# EAGLE design pce_pll (EAGLE 9.2.1)
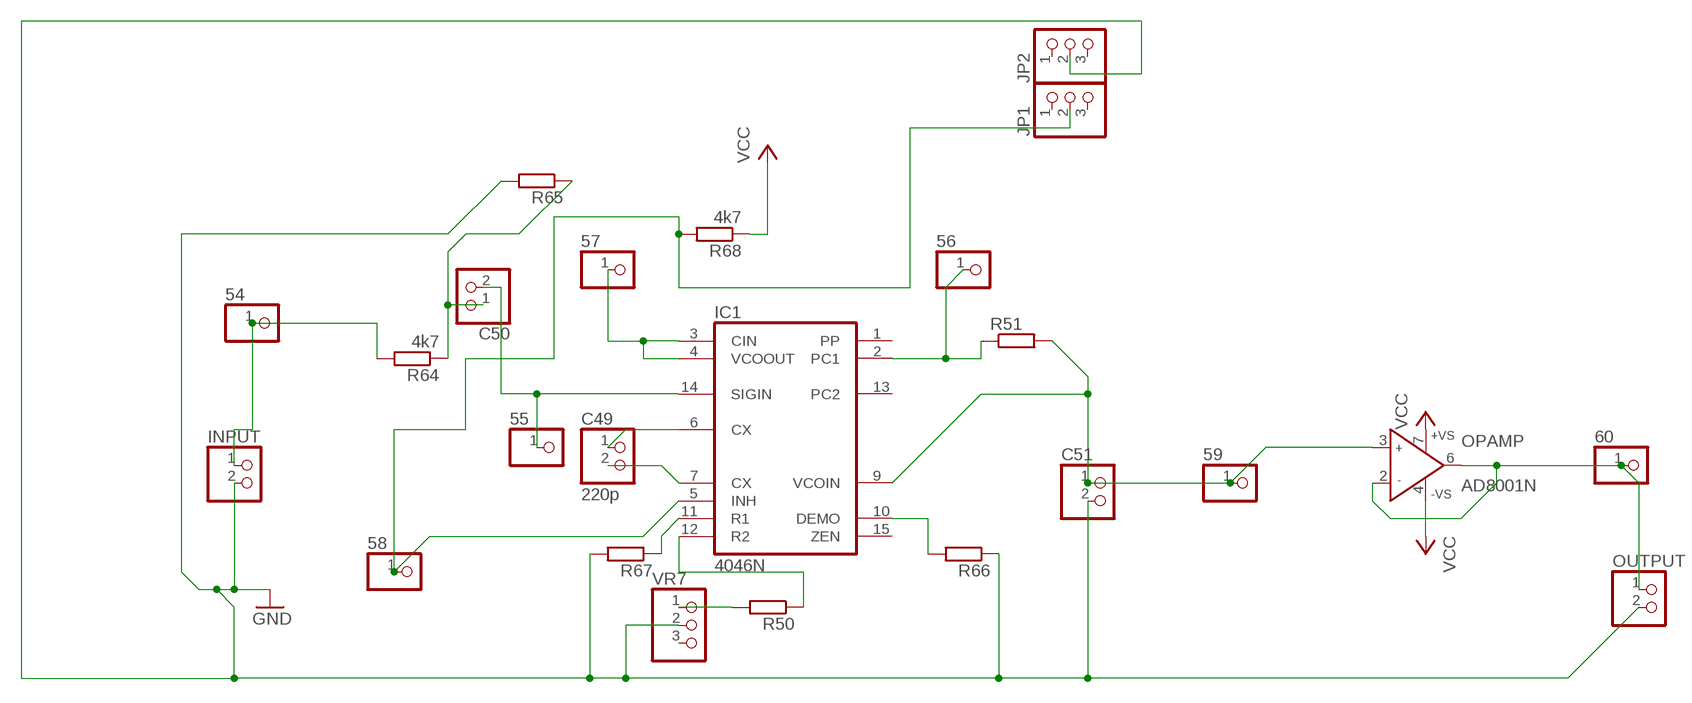
[diagram p0: schematic, sheet 1]

## Parts
54  PINHD-1X1  [1X01]
55  PINHD-1X1  [1X01]
56  PINHD-1X1  [1X01]
57  PINHD-1X1  [1X01]
58  PINHD-1X1  [1X01]
59  PINHD-1X1  [1X01]
60  PINHD-1X1  [1X01]
C49  220p  PINHD-1X2  [1X02]
C50  PINHD-1X2  [1X02]
C51  PINHD-1X2  [1X02]
IC1  4046N  [DIL16]
INPUT  PINHD-1X2  [1X02]
JP1  PINHD-1X3  [1X03]
JP2  PINHD-1X3  [1X03]
OPAMP  AD8001N  [DIL08]
OUTPUT  PINHD-1X2  [1X02]
R50  R-EU_0207/10  [0207/10]
R51  R-EU_0207/10  [0207/10]
R64  4k7  R-EU_0207/10  [0207/10]
R65  R-EU_0207/10  [0207/10]
R66  R-EU_0207/10  [0207/10]
R67  R-EU_0207/10  [0207/10]
R68  4k7  R-EU_0207/10  [0207/10]
VR7  PINHD-1X3  [1X03]

## Nets
54: 54.1 INPUT.1 R64.2
GND: C51.2 INPUT.2 JP2.2 OUTPUT.2 R65.2 R66.1 R67.2 VR7.2
N$1: 57.1 IC1.3(CIN) IC1.4(VCOOUT)
N$2: 56.1 IC1.2(PC1) R51.1
N$3: IC1.10(DEMO) R66.2
N$4: 55.1 C50.2 IC1.14(SIGIN)
N$5: C50.1 R64.1 R65.1
N$6: C49.1 IC1.6(CX)
N$7: C49.2 IC1.7(CX)
N$8: IC1.12(R2) R50.1
N$9: IC1.11(R1) R67.1
N$10: 60.1 OPAMP.2(IN-) OPAMP.6(OUT) OUTPUT.1
N$11: 59.1 C51.1 IC1.9(VCOIN) OPAMP.3(IN+) R51.2
N$13: 58.1 IC1.5(INH) JP1.2 R68.2
N$14: R50.2 VR7.1
VCC: OPAMP.4(-VS) OPAMP.7(+VS) R68.1
Unconnected: IC1.1(PP) IC1.13(PC2) IC1.15(ZEN) JP1.1 JP1.3 JP2.1 JP2.3 VR7.3

## Power pins joined to a net without a drawn wire
VDD: IC1.16(VDD)
VSS: IC1.8(VSS)

## Library data of the parts
54-60 = pinhead:PINHD-1X1: PIN HEADER
C49-C51 INPUT OUTPUT = pinhead:PINHD-1X2: PIN HEADER
IC1 = 40xx:4046: Micropower PLL
JP1 JP2 VR7 = pinhead:PINHD-1X3: PIN HEADER
OPAMP = analog-devices:AD8001: 800 MHz, 50 mW Current Feedback Amplifier Source: http://www.analog.com/static/imported-files/data_sheets/AD8001.pdf; MPN: AD8001ANZ; OC_FARNELL: 9605304; OC_NEWARK: 19M0911
R50 R51 R64-R68 = resistor:R-EU_: RESISTOR, European symbol

## Board
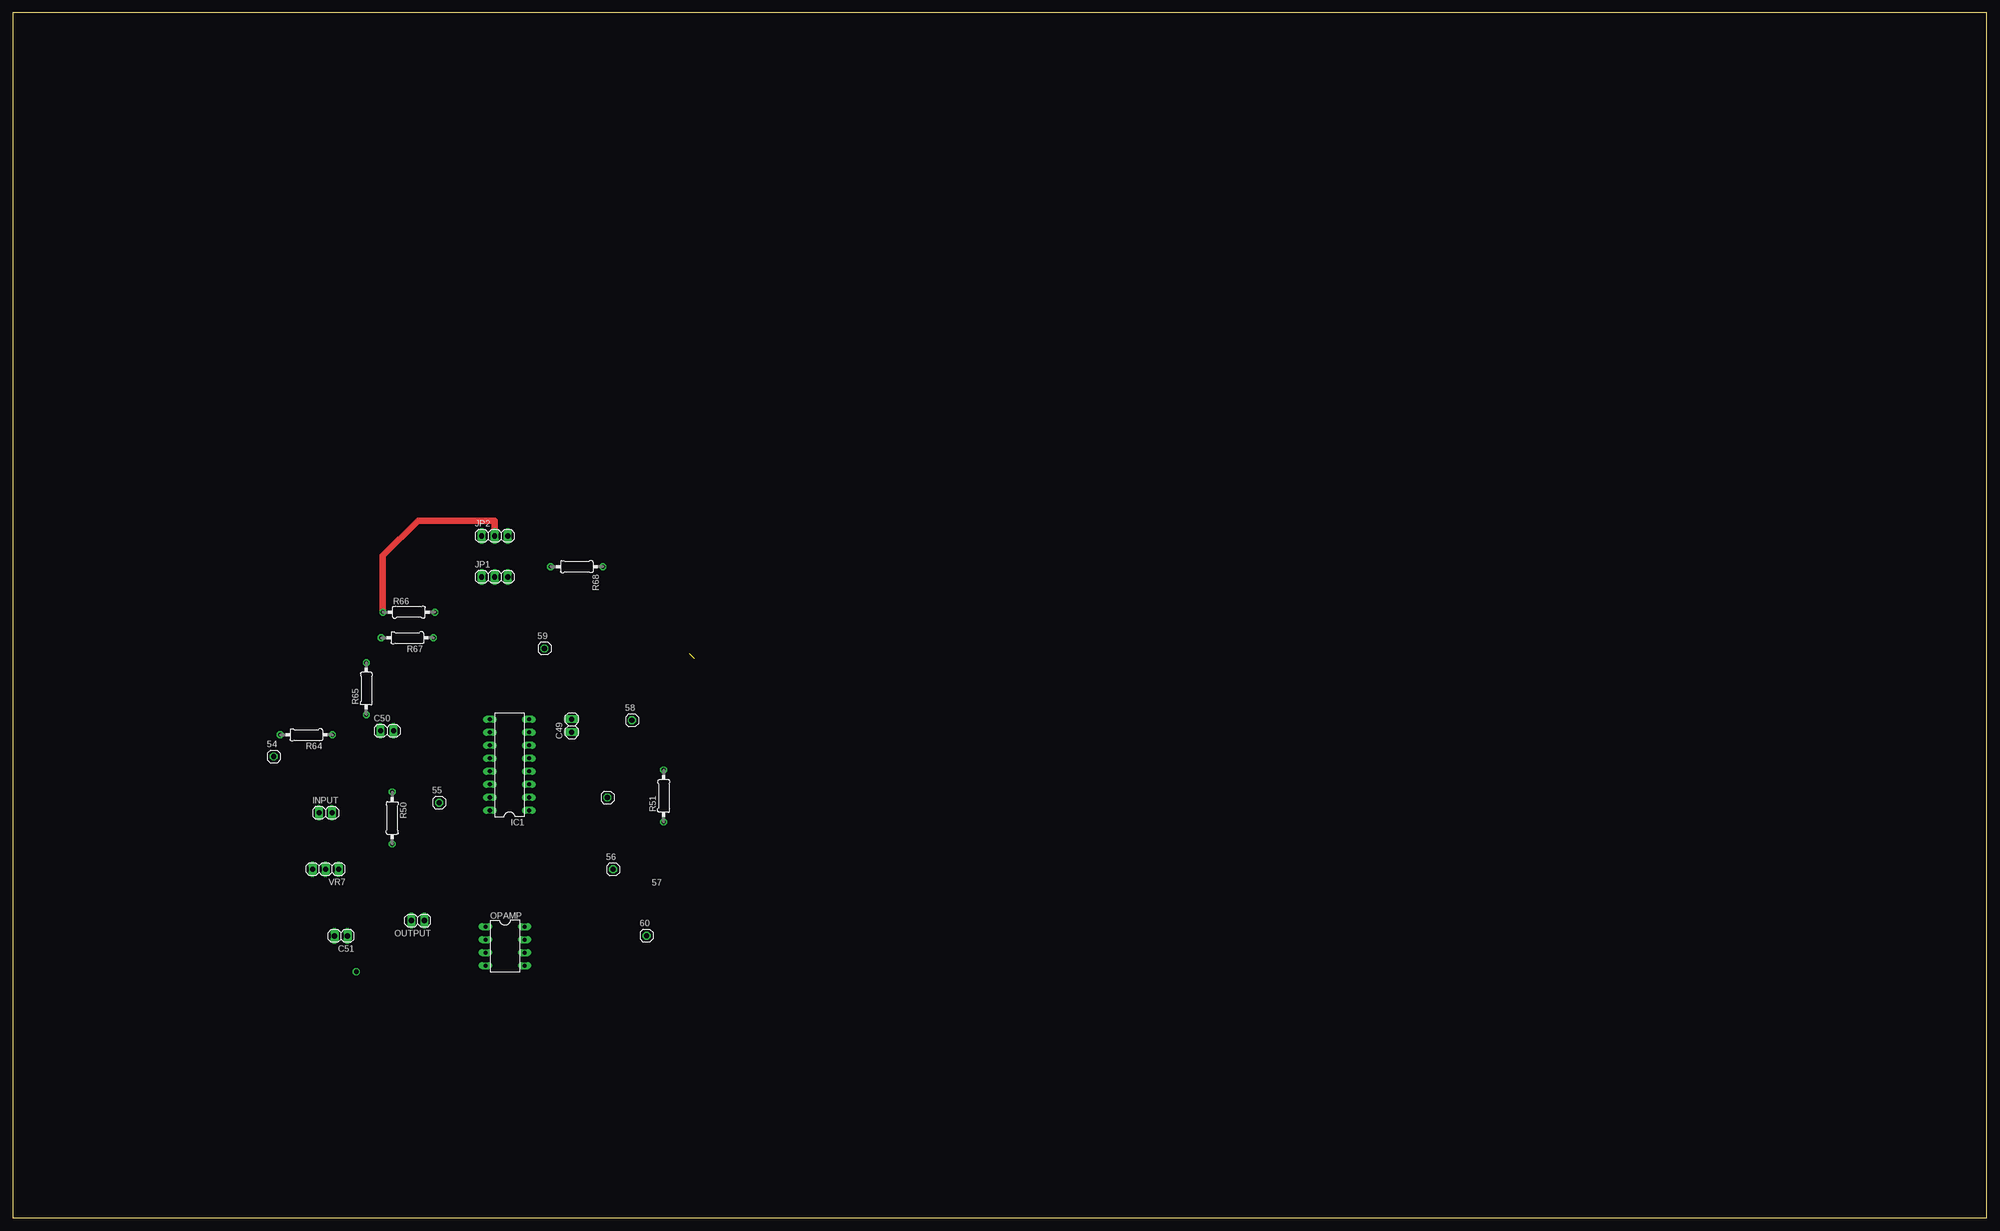
[diagram p1: board, top side]
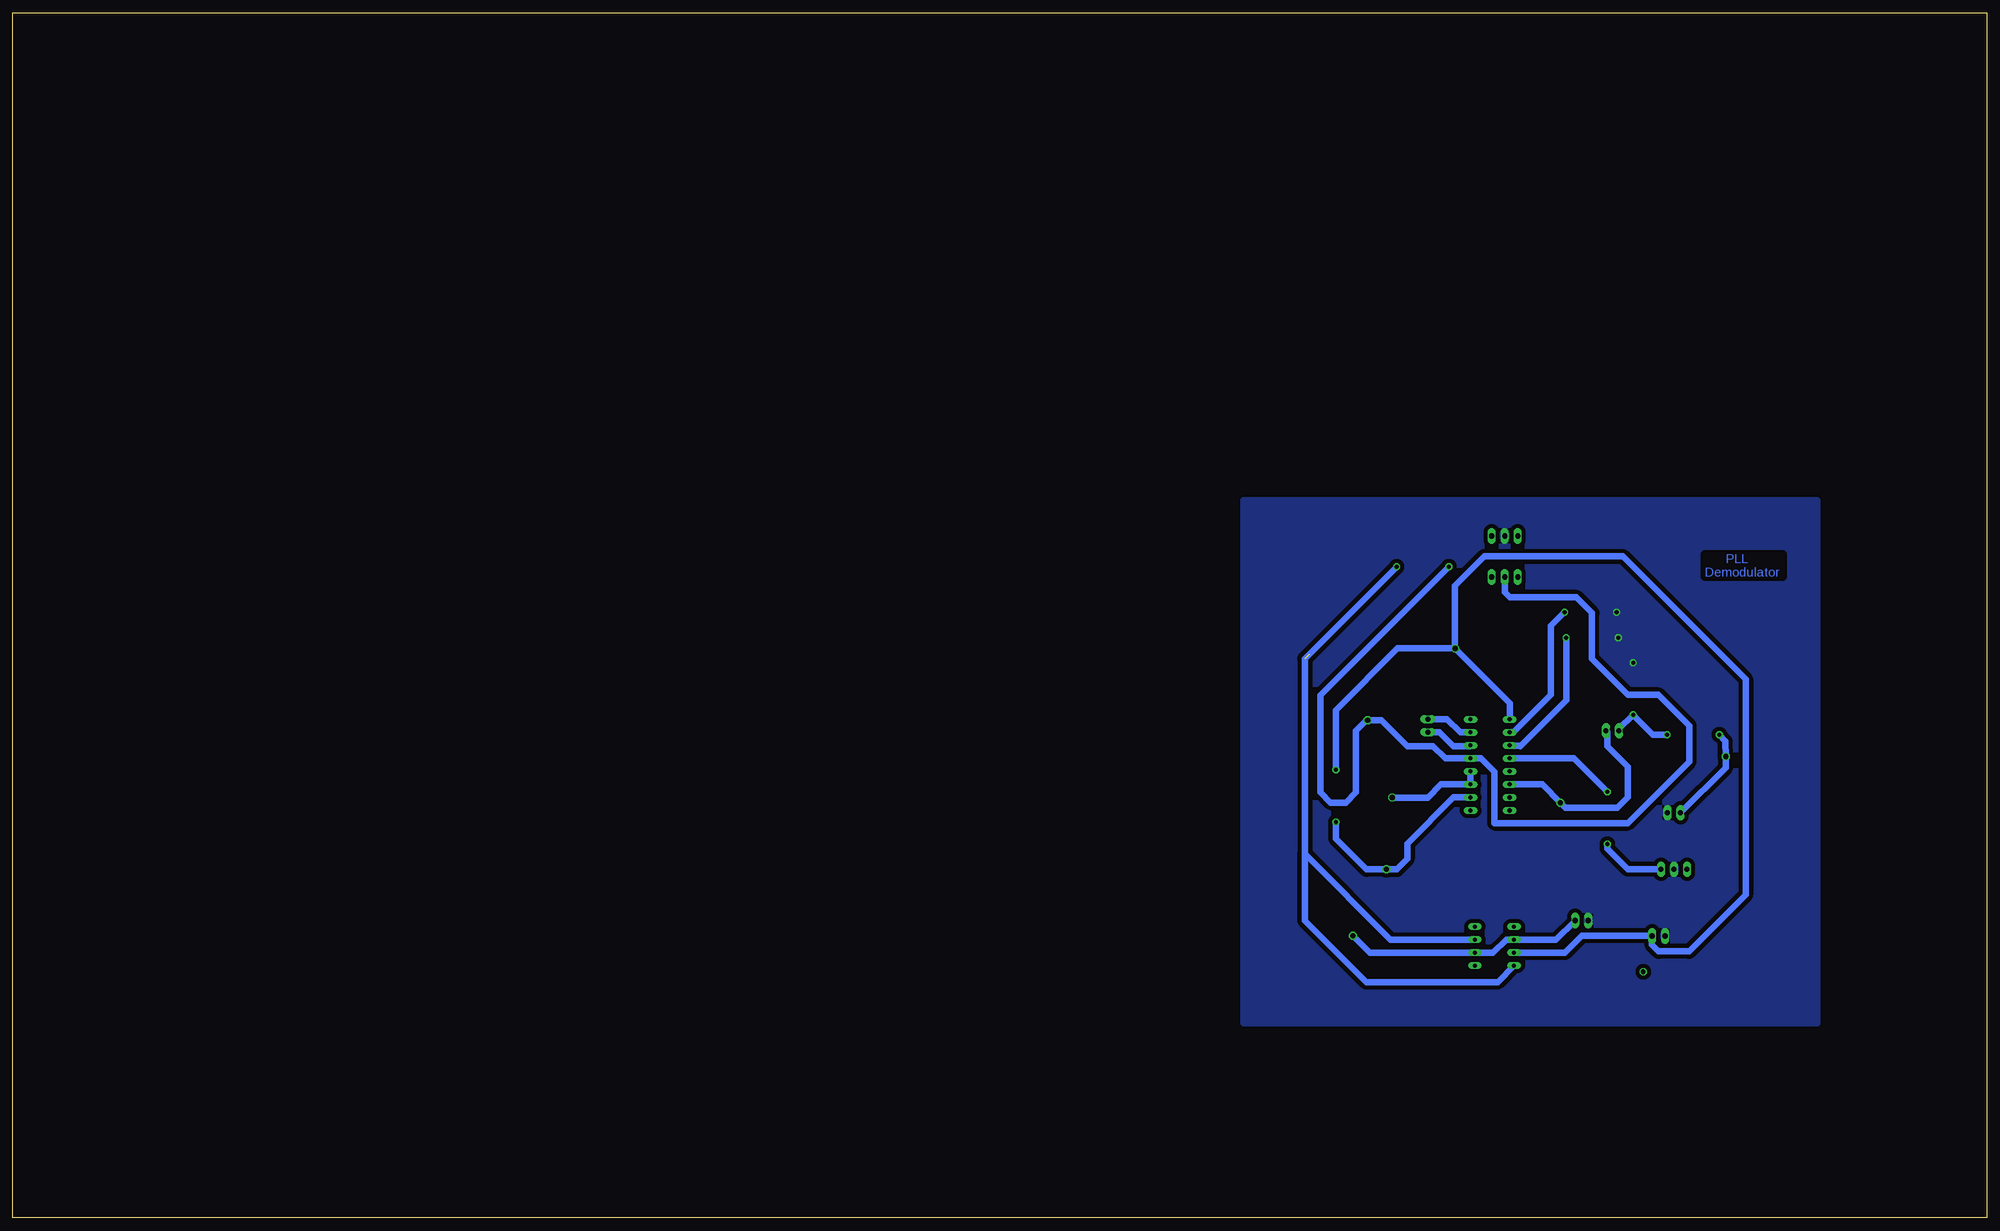
[diagram p2: board, bottom side, seen from below]

Size 385 x 235 mm. Coordinates in mm from the lower left corner, seen from the top.
Outline: 0,0 385,0 385,235 0,235 0,0
Copper layers (1*16): Top 0.035mm / dielectric 1.5mm / Bottom 0.035mm
Design rules "default": minimum track width 6mil, minimum drill 0.35mm, track to track 6mil, track to pad 6mil, pad to pad 6mil, via to via 6mil, smd to smd 6mil, copper to edge 40mil, drill to drill 6mil, minimum pad ring 10mil, minimum via ring 8mil, stop-mask expansion 4mil, vias tented up to drill 0mil, thermal gap 10mil

### Footprints (pad centres in the part's own frame; a part is rotated, then mirrored left to right if it is on the bottom)
1X01 = drill 1.016 octagon: 1 0,0
1X02 = drill 1.016 long: 1 -1.27,0; 2 1.27,0
DIL16 = drill 0.813 long: 1 -8.89,-3.81; 2 -6.35,-3.81; 3 -3.81,-3.81; 4 -1.27,-3.81; 5 1.27,-3.81; 6 3.81,-3.81; 7 6.35,-3.81; 8 8.89,-3.81; 9 8.89,3.81; 10 6.35,3.81; 11 3.81,3.81; 12 1.27,3.81; 13 -1.27,3.81; 14 -3.81,3.81; 15 -6.35,3.81; 16 -8.89,3.81
1X03 = drill 1.016 long: 1 -2.54,0; 2 0,0; 3 2.54,0
DIL08 = drill 0.813 long: 1 -3.81,-3.81; 2 -1.27,-3.81; 3 1.27,-3.81; 4 3.81,-3.81; 5 3.81,3.81; 6 1.27,3.81; 7 -1.27,3.81; 8 -3.81,3.81
0207/10 = drill 0.813 octagon: 1 -5.08,0; 2 5.08,0

### Placement (x,y rotation side)
54  50.9,89.97 0 top
55  83.14,80.97 0 top
56  117.06,67.97 0 top
57  115.98,81.97 0 top
58  120.76,97.05 0 top
59  103.68,111.05 0 top
60  123.6,55.05 0 top
C49  109,96 90 top
C50  73,95 0 top
C51  64,55 180 top
IC1  96.87,88.35 90 top
INPUT  61,79 0 top
JP1  94,125 0 top
JP2  94,133 0 top
OPAMP  96,53 270 top
OUTPUT  79,58 180 top
R50  74,78 270 top
R51  126.95,82.29 90 top
R64  57.25,94.21 180 top
R65  68.95,103.21 90 top
R66  77.25,118.13 0 top
R67  76.95,113.13 180 top
R68  110,127 180 top
VR7  61,68 180 top

### Tracks (layer width: path | path; a pad name or v marks a point on that pad's centre or on a via)
54
  Bottom 1.27: INPUT.1 50.9,87.83 54.1 51,93 R64.2
GND
  Top 1.27: R66.1 72.17,129.13 79.04,136 94,136 JP2.2
  pour Bottom (isolate 0.813): 33,38 145,38 145,140 33,140
N$1
  Bottom 1.27: IC1.4 IC1.3 106.46,84.54 109.03,81.97 57.1
N$2
  Bottom 1.27: IC1.2 104,82 113,73 113,70 115.03,67.97 56.1 120.97,67.97 126.95,73.95 R51.1
N$3
  Bottom 1.27: R66.2 85,115.46 85,102 92.3,94.7 IC1.10
N$4
  Bottom 1.27: IC1.14 86.71,84.54 55.1 82.17,80 72,80 70,82 70,88 74,92 74,94.73 C50.2
N$5
  Bottom 0.152: R65.1 68.95,98 68.95,97.78
  Bottom 1.27: R64.1 65.16,94.21 68.95,98 | R65.1 71.73,95.35 C50.1
N$6
  Bottom 1.27: IC1.6 100.84,92 104,92 106.73,94.73 C49.1
N$7
  Bottom 1.27: IC1.7 102.7,94.7 105.27,97.27 C49.2
N$8
  Bottom 1.27: R50.1 80.54,89.62 IC1.12
N$9
  Bottom 0.152: 93.06,92.06 IC1.11
  Bottom 1.27: R67.1 82.03,100.97 91,92 91.06,92.06 93.06,92.06
N$10
  Bottom 1.27: 60.1 120.28,51.73 OPAMP.6 96.27,51.73 93.73,54.27 OPAMP.2 84,54.27 OUTPUT.1
N$11
  Bottom 0.152: C51.1 65.27,54.73
  Bottom 1.27: 59.1 114.95,111.05 126.95,99.05 R51.2 | 59.1 93,100.37 93,97.3 IC1.9 | 59.1 103.68,123.32 98,129 71,129 47,105 47,63 58,52 64,52 65.27,53.27 C51.1 79,55 82.27,51.73 OPAMP.3
N$12  (via drill 0.9)
  other vias: 67,48
N$13
  Bottom 1.27: R68.2 130,101.92 130,83 128,81 125,81 123,83 123,95 120.95,97.05 58.1 118.05,97.05 113,92 108,92 105.62,89.62 IC1.5 98.62,89.62 96,87 96,77 70,77 58,89 58,96 64,102 70,102 77,109 77,118 80,121 93,121 94,122 JP1.2
N$14
  Bottom 1.27: VR7.1 70,68 74,72 R50.2
VCC  (1 unrouted)
  Bottom 0.152: 100.54,55 OPAMP.7 | 132,110.08 132,110
  Bottom 1.27: R68.1 133,109.08 133,71 | 133,71 116.27,54.27 OPAMP.7 | OPAMP.4 95.38,46 121,46 133,58 133,71

### Text on the board
Bottom: PLL / Demodulator